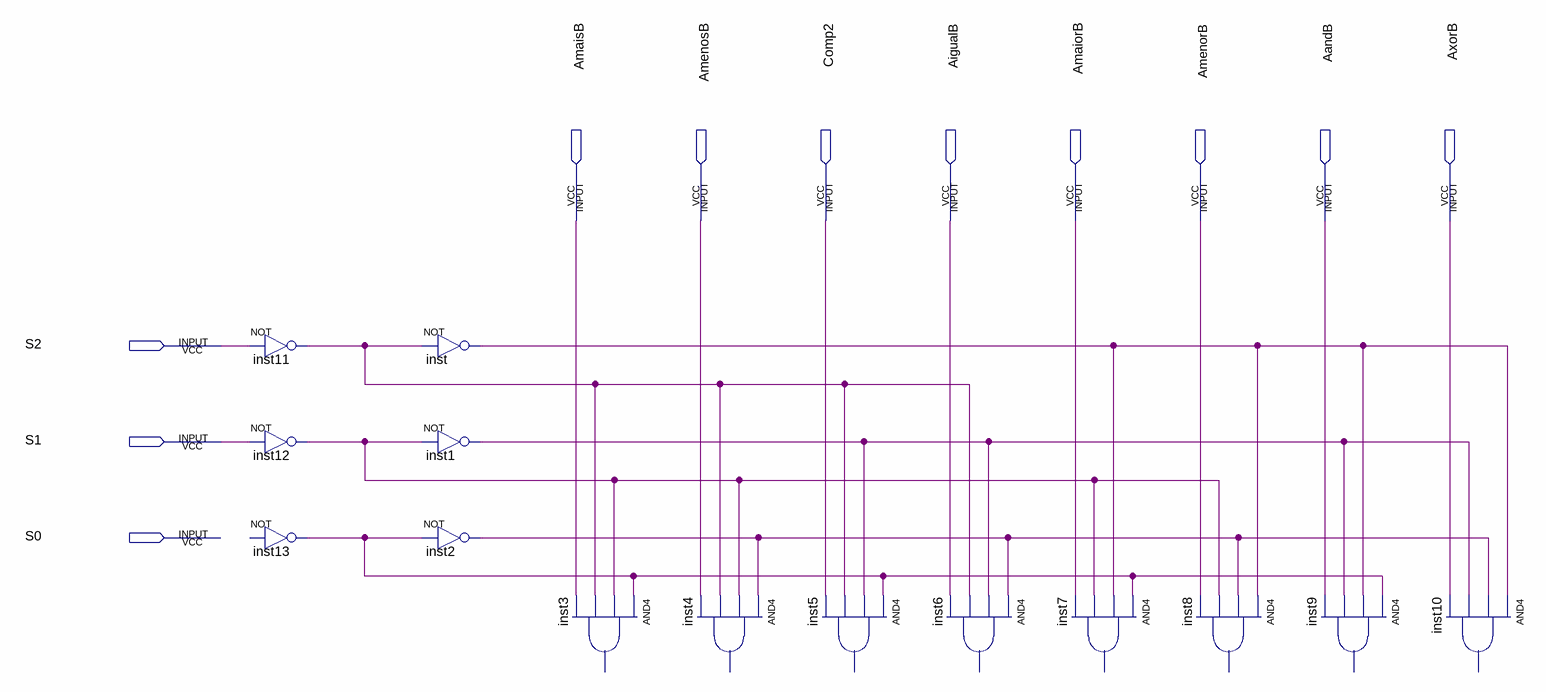
[diagram p0: schematic sheet]
// Quartus schematic Mux81.bdf as structural Verilog: 14 symbols, 11 pins
module Mux81 (
  input  AmaisB,
  input  AmenosB,
  input  Comp2,
  input  AigualB,
  input  AmaiorB,
  input  AmenorB,
  input  AandB,
  input  AxorB,
  input  S2,
  input  S1,
  input  S0
);

  wire inst1_out, inst2_out, inst11_out, inst12_out, inst13_out, inst_out;

  not inst11 (inst11_out, S2);
  not inst12 (inst12_out, S1);
  // NOT inst13 has open pins: IN=open, OUT=inst13_out
  not inst (inst_out, inst11_out);
  not inst1 (inst1_out, inst12_out);
  not inst2 (inst2_out, inst13_out);
  // AND4 inst3 has open pins: IN1=inst13_out, IN2=inst12_out, IN3=inst11_out, IN4=AmaisB, OUT=open
  // AND4 inst4 has open pins: IN1=inst2_out, IN2=inst12_out, IN3=inst11_out, IN4=AmenosB, OUT=open
  // AND4 inst5 has open pins: IN1=inst13_out, IN2=inst1_out, IN3=inst11_out, IN4=Comp2, OUT=open
  // AND4 inst6 has open pins: IN1=inst2_out, IN2=inst1_out, IN3=inst11_out, IN4=AigualB, OUT=open
  // AND4 inst7 has open pins: IN1=inst13_out, IN2=inst_out, IN3=inst12_out, IN4=AmaiorB, OUT=open
  // AND4 inst8 has open pins: IN1=inst_out, IN2=inst2_out, IN3=inst12_out, IN4=AmenorB, OUT=open
  // AND4 inst9 has open pins: IN1=inst13_out, IN2=inst_out, IN3=inst1_out, IN4=AandB, OUT=open
  // AND4 inst10 has open pins: IN1=inst_out, IN2=inst2_out, IN3=inst1_out, IN4=AxorB, OUT=open
endmodule
